# EAGLE design QuadADSR (EAGLE 9.1.1)

## Sheet 1 of 3
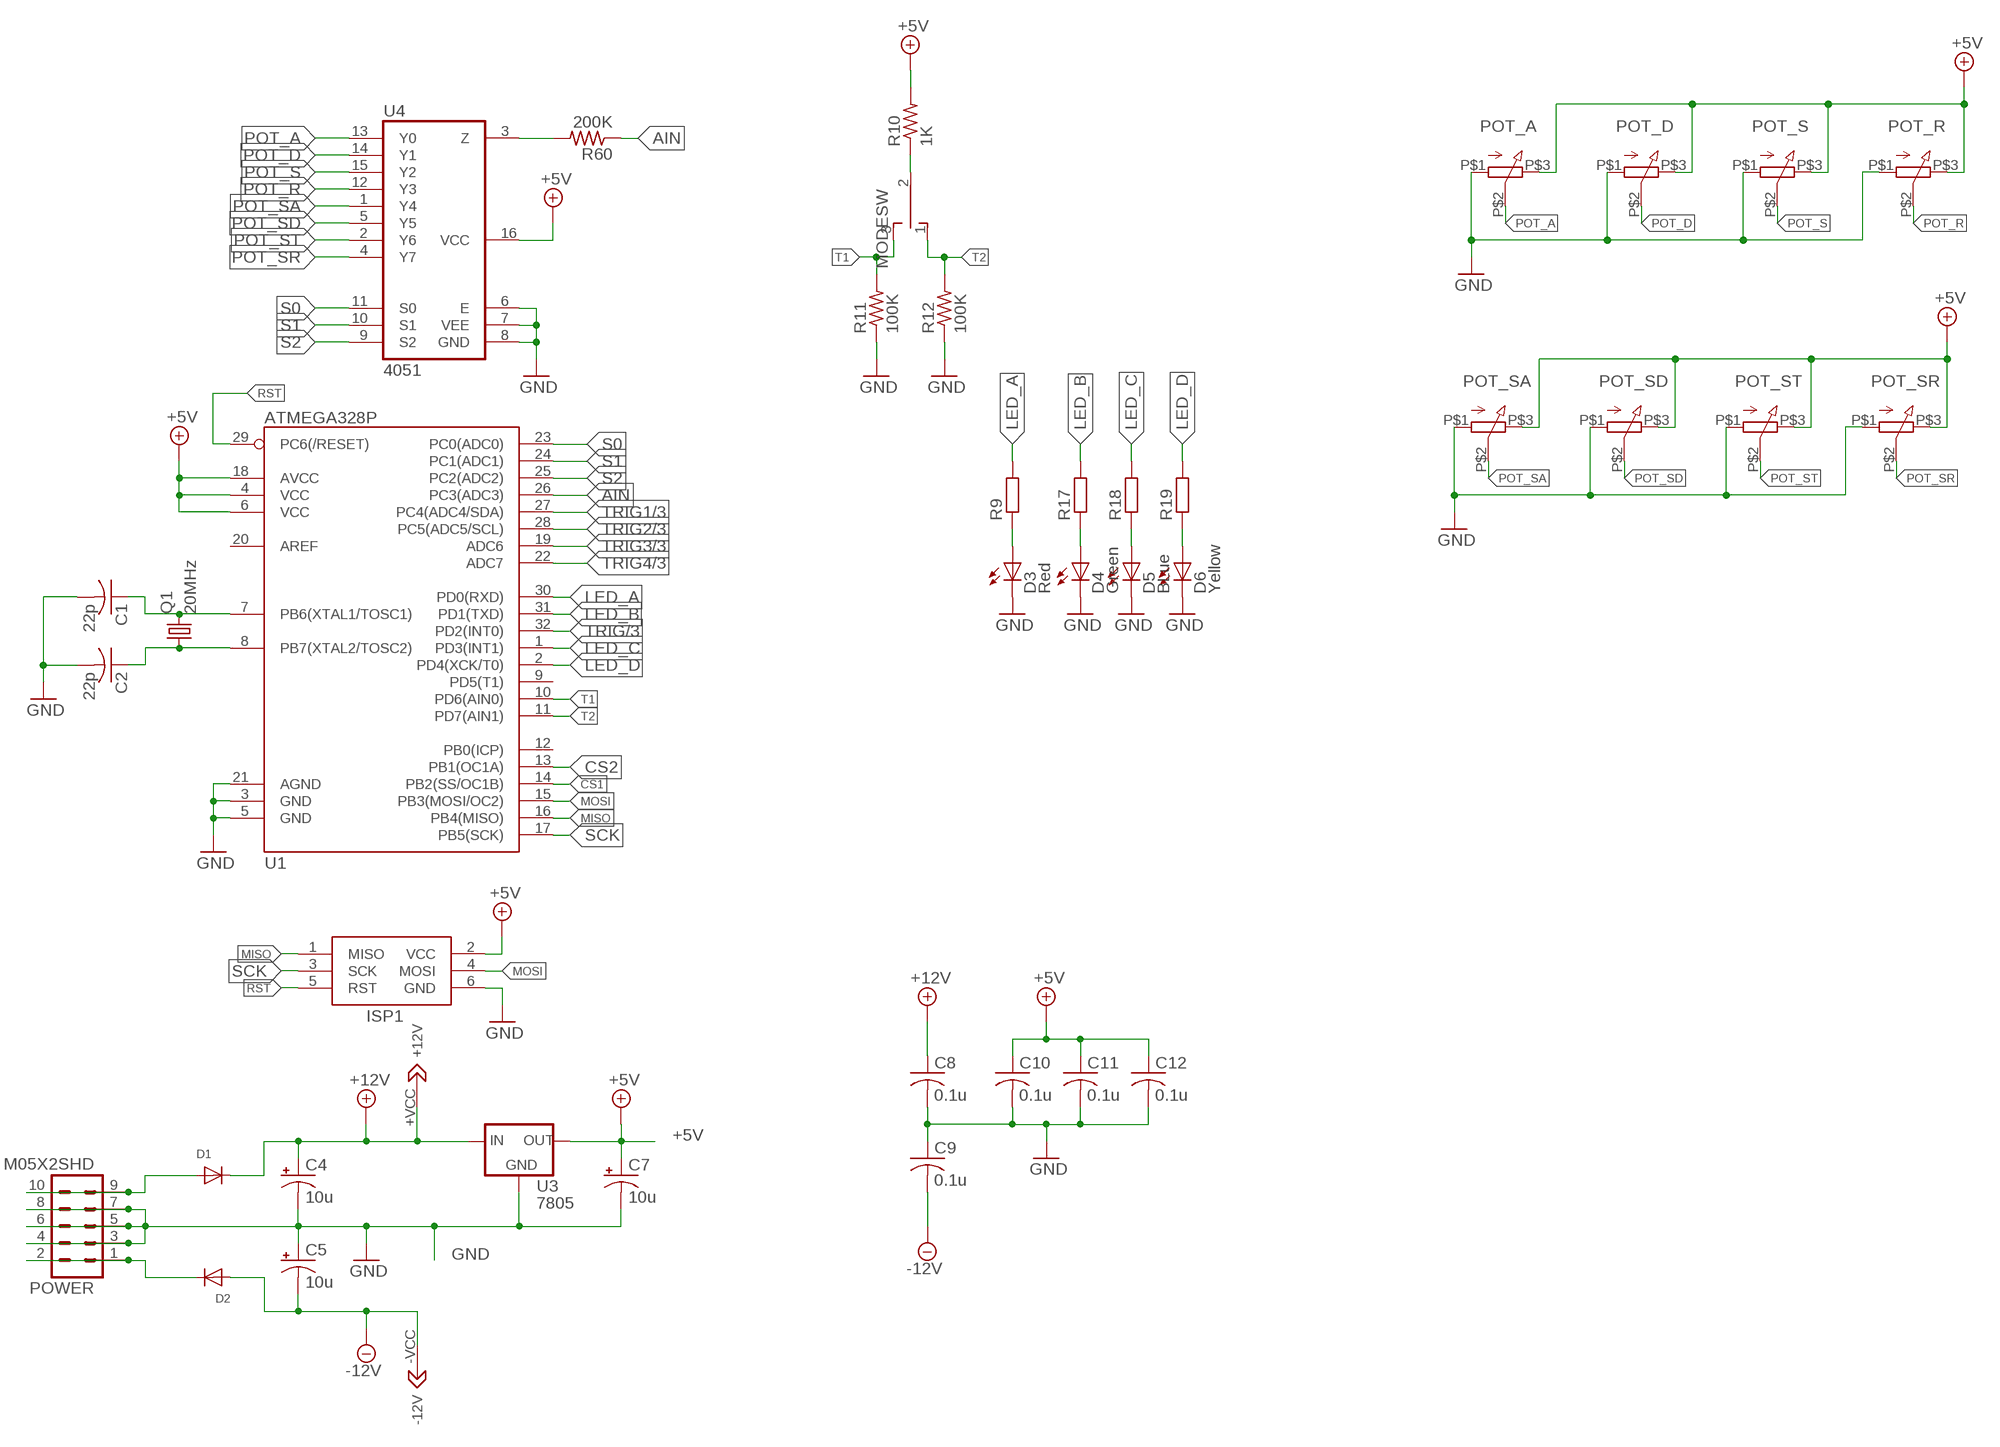
[diagram p0: schematic, sheet 1]

### Parts
C1  22p  C-USC0805K  [C0805K]
C2  22p  C-USC0805K  [C0805K]
C4  10u  CPOL-US153CLV-0505  [153CLV-0505]
C5  10u  CPOL-US153CLV-0505  [153CLV-0505]
C7  10u  CPOL-US153CLV-0505  [153CLV-0505]
C8  0.1u  C-USC0805K  [C0805K]
C9  0.1u  C-USC0805K  [C0805K]
C10  0.1u  C-USC0805K  [C0805K]
C11  0.1u  C-USC0805K  [C0805K]
C12  0.1u  C-USC0805K  [C0805K]
D1  DIODESMA  [SMADIODE]
D2  DIODESMA  [SMADIODE]
D3  Red  LED5MM  [LED5MM]
D4  Green  LED5MM  [LED5MM]
D5  BLue  LED5MM  [LED5MM]
D6  Yellow  LED5MM  [LED5MM]
ISP1  AVRISP-6  [AVRISP]
MODESW  TOGGLE_ON_OFF_ON  [TOGGLE_ON_OFF_ON]
POT_A  Q-POT  [Q-POT]
POT_D  Q-POT  [Q-POT]
POT_R  Q-POT  [Q-POT]
POT_S  Q-POT  [Q-POT]
POT_SA  Q-POT  [Q-POT]
POT_SD  Q-POT  [Q-POT]
POT_SR  Q-POT  [Q-POT]
POT_ST  Q-POT  [Q-POT]
POWER  M05X2SHD  [2X5-SHROUDED]
Q1  20MHz  CRYSTALHC49UP  [HC49UP]
R9  R-EU_R0805  [R0805]
R10  1K  R-US_R0805  [R0805]
R11  100K  R-US_R0805  [R0805]
R12  100K  R-US_R0805  [R0805]
R17  R-EU_R0805  [R0805]
R18  R-EU_R0805  [R0805]
R19  R-EU_R0805  [R0805]
R60  200K  R-US_R0805  [R0805]
U1  ATMEGA328P  ATMEGA328_SMT  [TQFP32-08]
U2  DUAL_OPAMP  [DUAL_OPAMP]
U3  7805  V-REG  [V-REG]
U4  4051  MUX!  [N2222_ARRAY]

### Nets
+5V: C7.+ C10.1 C11.1 C12.1 ISP1.2(VCC) POT_A.P$3 POT_D.P$3 POT_R.P$3 POT_S.P$3 POT_SA.P$3 POT_SD.P$3 POT_SR.P$3 POT_ST.P$3 R10.2 U1.4(VCC) U1.6(VCC) U1.18(AVCC) U3.3(OUT) U4.16(VCC) ; also sheet 2,3
+12V [Power]: C4.+ C8.1 D1.C U2.+VCC(+12V) U3.1(IN)
-12V [Power]: C5.- C9.2 D2.A U2.-VCC(-12V)
AIN: R60.1 U1.26(PC3(ADC3))
CS1: U1.14(PB2(SS/OC1B)) ; also sheet 2
CS2: U1.13(PB1(OC1A)) ; also sheet 2
GND [Power]: C1.2 C2.2 C4.- C5.+ C7.- C8.2 C9.1 C10.2 C11.2 C12.2 D3.K(C) D4.K(C) D5.K(C) D6.K(C) ISP1.6(GND) POT_A.P$1 POT_D.P$1 POT_R.P$1 POT_S.P$1 POT_SA.P$1 POT_SD.P$1 POT_SR.P$1 POT_ST.P$1 POWER.3 POWER.4 POWER.5 POWER.6 POWER.7 POWER.8 R11.1 R12.1 U1.3(GND) U1.5(GND) U1.21(AGND) U3.4(GND) U4.6(E) U4.7(VEE) U4.8(GND) ; also sheet 2,3
LED_A: R9.2 U1.30(PD0(RXD))
LED_B: R17.2 U1.31(PD1(TXD))
LED_C: R18.2 U1.1(PD3(INT1))
LED_D: R19.2 U1.2(PD4(XCK/T0))
MISO: ISP1.1(MISO) U1.16(PB4(MISO))
MOSI: ISP1.4(MOSI) U1.15(PB3(MOSI/OC2)) ; also sheet 2
N$1: C1.1 Q1.2 U1.7(PB6(XTAL1/TOSC1))
N$2: C2.1 Q1.1 U1.8(PB7(XTAL2/TOSC2))
N$9: D1.A POWER.9 POWER.10
N$10: D2.C POWER.1 POWER.2
N$12: MODESW.2(P) R10.1
N$19: D3.A R9.1
N$20: D4.A R17.1
N$21: D5.A R18.1
N$22: D6.A R19.1
N$69: R60.2 U4.3(Z)
POT_A: POT_A.P$2 U4.13(Y0)
POT_D: POT_D.P$2 U4.14(Y1)
POT_R: POT_R.P$2 U4.12(Y3)
POT_S: POT_S.P$2 U4.15(Y2)
POT_SA: POT_SA.P$2 U4.1(Y4)
POT_SD: POT_SD.P$2 U4.5(Y5)
POT_SR: POT_SR.P$2 U4.4(Y7)
POT_ST: POT_ST.P$2 U4.2(Y6)
RST: ISP1.5(RST) U1.29(PC6(/RESET))
S0: U1.23(PC0(ADC0)) U4.11(S0)
S1: U1.24(PC1(ADC1)) U4.10(S1)
S2: U1.25(PC2(ADC2)) U4.9(S2)
SCK: ISP1.3(SCK) U1.17(PB5(SCK)) ; also sheet 2
T1: MODESW.3(S) R11.2 U1.10(PD6(AIN0))
T2: MODESW.1(O) R12.2 U1.11(PD7(AIN1))
TRIG: U1.32(PD2(INT0)) ; also sheet 3
TRIG1: U1.27(PC4(ADC4/SDA)) ; also sheet 3
TRIG2: U1.28(PC5(ADC5/SCL)) ; also sheet 3
TRIG3: U1.19(ADC6) ; also sheet 3
TRIG4: U1.22(ADC7) ; also sheet 3
Unconnected: U1.9(PD5(T1)) U1.12(PB0(ICP)) U1.20(AREF) U2.1OUT(OUT) U2.2OUT(OUT) U2.+1IN(+IN) U2.+2IN(+IN) U2.-1IN(-IN) U2.-2IN(-IN)

## Sheet 2 of 3
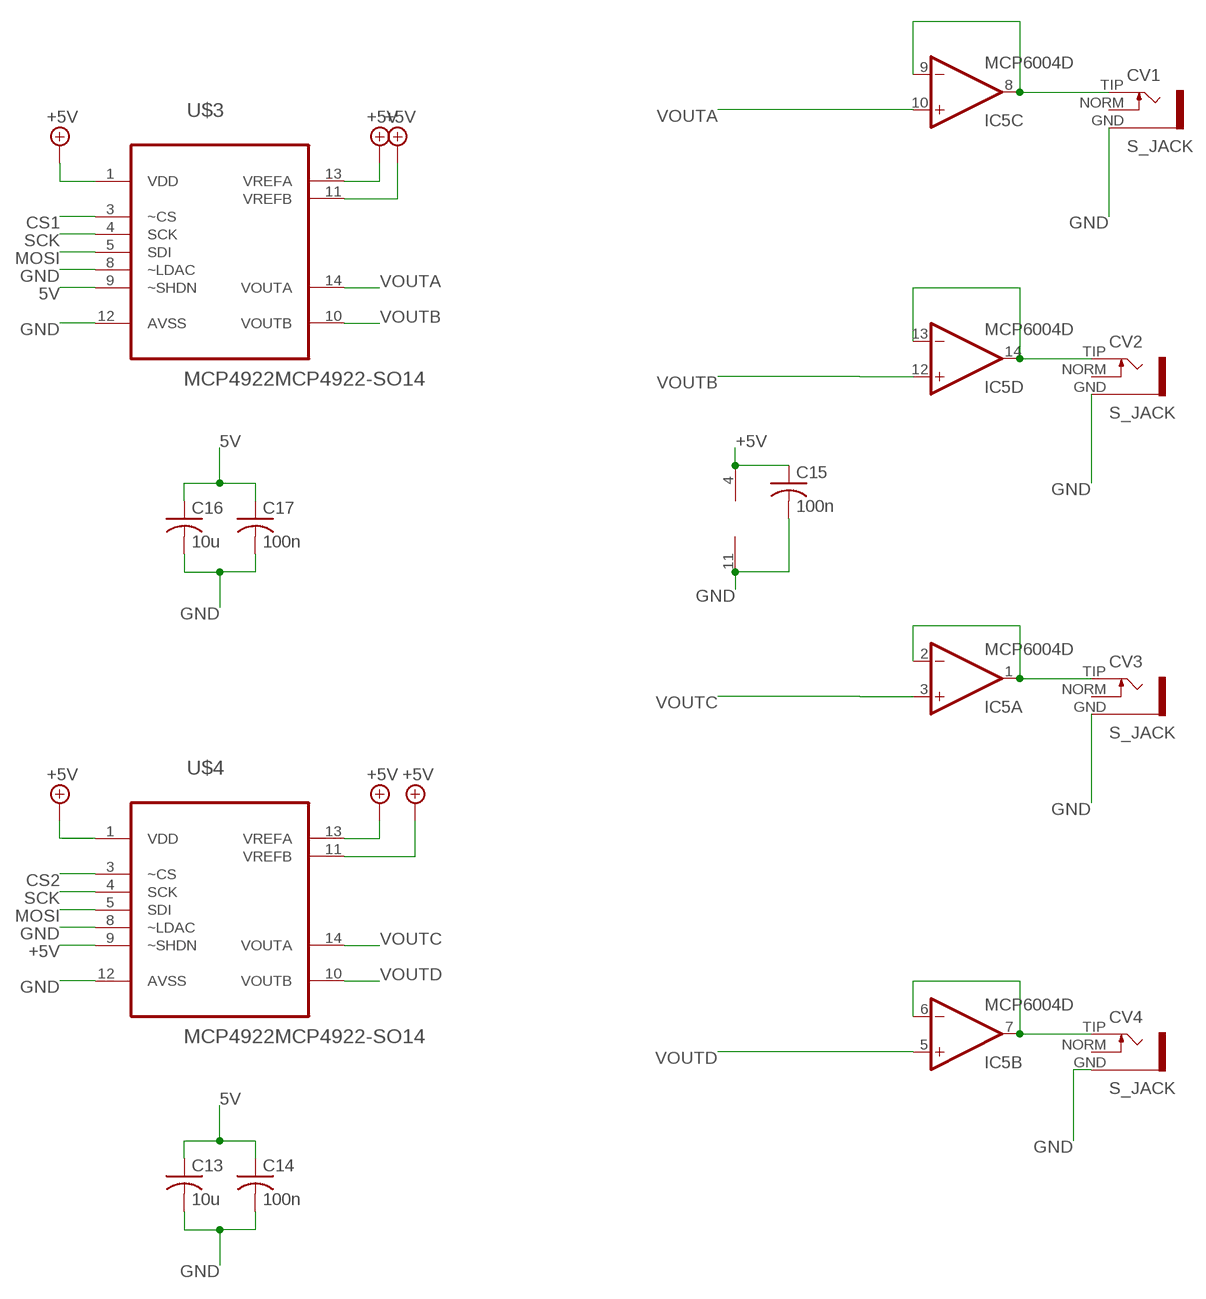
[diagram p1: schematic, sheet 2]

### Parts
C13  10u  C-USC0805K  [C0805K]
C14  100n  C-USC0805K  [C0805K]
C15  100n  C-USC0805K  [C0805K]
C16  10u  C-USC0805K  [C0805K]
C17  100n  C-USC0805K  [C0805K]
CV1  S_JACK  [S_JACK]
CV2  S_JACK  [S_JACK]
CV3  S_JACK  [S_JACK]
CV4  S_JACK  [S_JACK]
IC5  MCP6004D  [SO14]
U$3  MCP4922MCP4922-SO14  [SO14]
U$4  MCP4922MCP4922-SO14  [SO14]

### Nets
5V [Power]: C13.1 C14.1 C16.1 C17.1 U$3.9(~SHDN)
+5V: C15.1 IC5.4(P:V+) U$3.1(VDD) U$3.11(VREFB) U$3.13(VREFA) U$4.1(VDD) U$4.9(~SHDN) U$4.11(VREFB) U$4.13(VREFA) ; also sheet 1,3
CS1: U$3.3(~CS) ; also sheet 1
CS2: U$4.3(~CS) ; also sheet 1
GND [Power]: C13.2 C14.2 C15.2 C16.2 C17.2 CV1.GND CV2.GND CV3.GND CV4.GND IC5.11(P:V-) U$3.8(~LDAC) U$3.12(AVSS) U$4.8(~LDAC) U$4.12(AVSS) ; also sheet 1,3
MOSI: U$3.5(SDI) U$4.5(SDI) ; also sheet 1
N$13: CV1.TIP IC5.8(C:OUT) IC5.9(C:-IN)
N$25: CV4.TIP IC5.6(B:-IN) IC5.7(B:OUT)
N$31: CV3.TIP IC5.1(A:OUT) IC5.2(A:-IN)
N$36: CV2.TIP IC5.13(D:-IN) IC5.14(D:OUT)
SCK: U$3.4(SCK) U$4.4(SCK) ; also sheet 1
VOUTA: IC5.10(C:+IN) U$3.14(VOUTA)
VOUTB: IC5.12(D:+IN) U$3.10(VOUTB)
VOUTC: IC5.3(A:+IN) U$4.14(VOUTA)
VOUTD: IC5.5(B:+IN) U$4.10(VOUTB)
Unconnected: CV1.NORM CV2.NORM CV3.NORM CV4.NORM

## Sheet 3 of 3
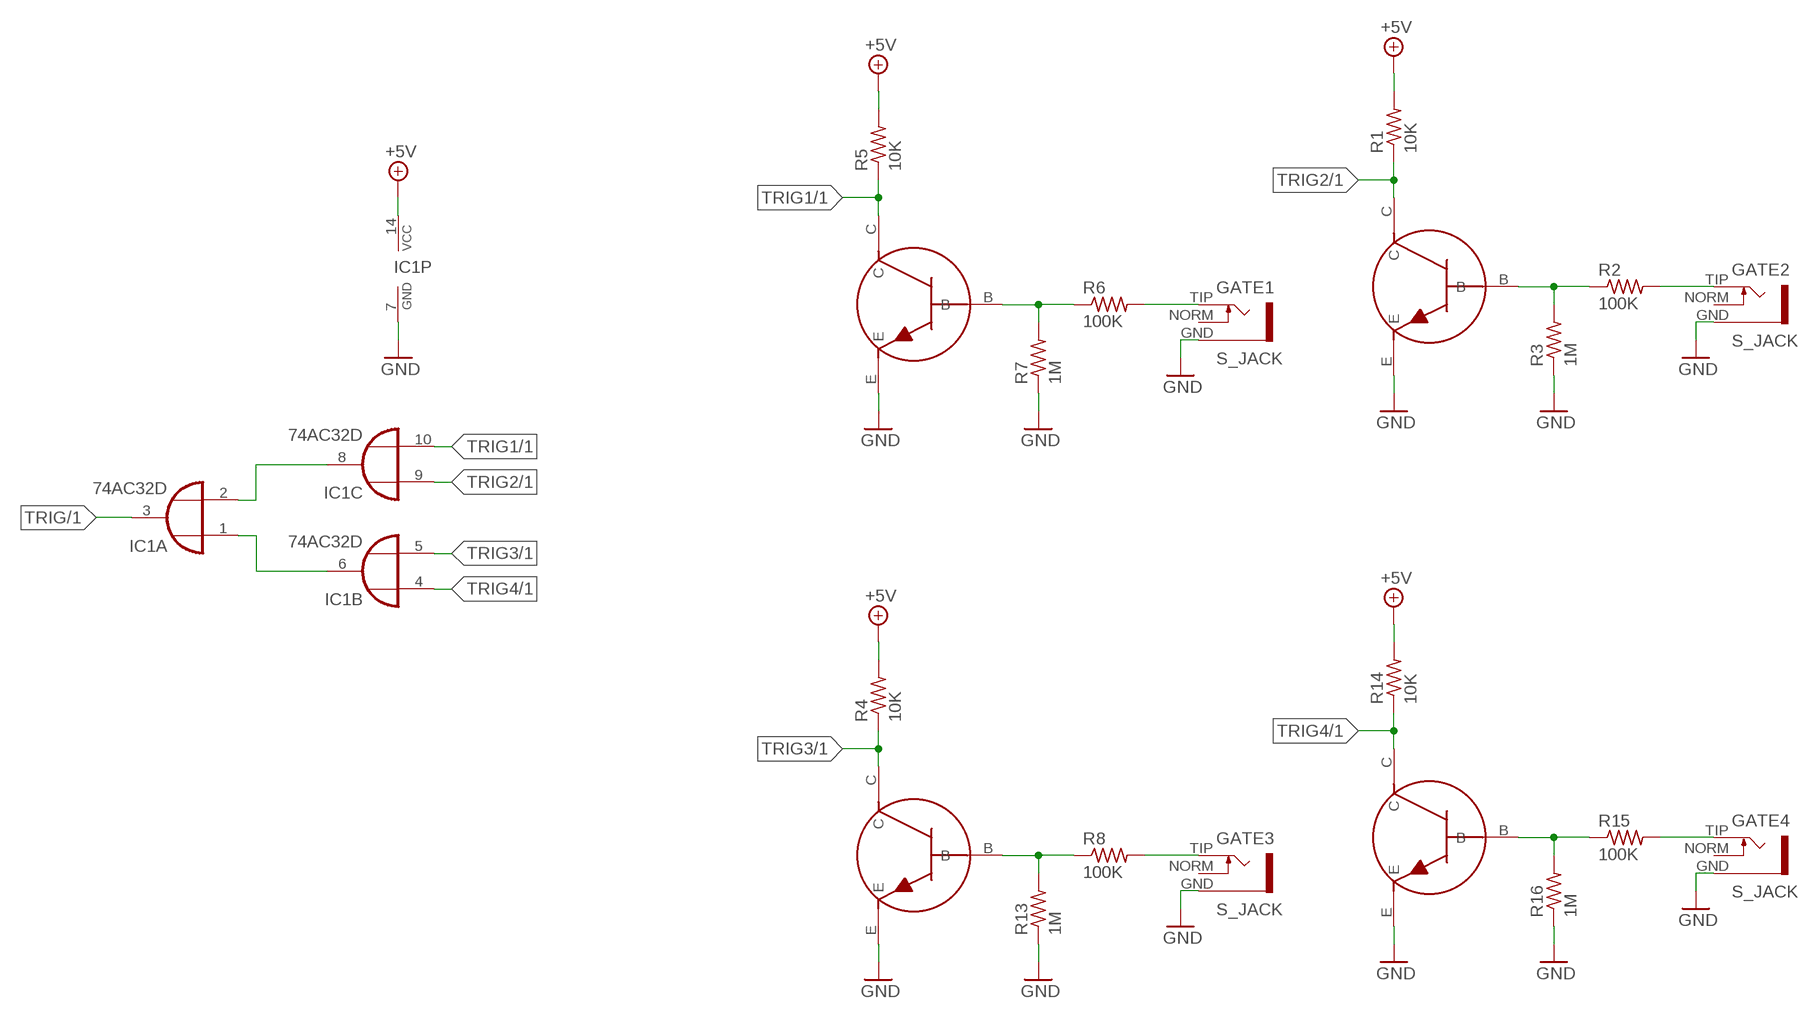
[diagram p2: schematic, sheet 3]

### Parts
GATE1  S_JACK  [S_JACK]
GATE2  S_JACK  [S_JACK]
GATE3  S_JACK  [S_JACK]
GATE4  S_JACK  [S_JACK]
IC1  74AC32D  [SO14]
R1  10K  R-US_R0805  [R0805]
R2  100K  R-US_R0805  [R0805]
R3  1M  R-US_R0805  [R0805]
R4  10K  R-US_R0805  [R0805]
R5  10K  R-US_R0805  [R0805]
R6  100K  R-US_R0805  [R0805]
R7  1M  R-US_R0805  [R0805]
R8  100K  R-US_R0805  [R0805]
R13  1M  R-US_R0805  [R0805]
R14  10K  R-US_R0805  [R0805]
R15  100K  R-US_R0805  [R0805]
R16  1M  R-US_R0805  [R0805]
T1  2N3904  TRANSISTOR_MMBT3904  [TRANSISTOR_SINGLE_N-TYPE]
T2  2N3904  TRANSISTOR_MMBT3904  [TRANSISTOR_SINGLE_N-TYPE]
T3  2N3904  TRANSISTOR_MMBT3904  [TRANSISTOR_SINGLE_N-TYPE]
T4  2N3904  TRANSISTOR_MMBT3904  [TRANSISTOR_SINGLE_N-TYPE]

### Nets
+5V: IC1.14(P:VCC) R1.2 R4.2 R5.2 R14.2 ; also sheet 1,2
GND [Power]: GATE1.GND GATE2.GND GATE3.GND GATE4.GND IC1.7(P:GND) R3.1 R7.1 R13.1 R16.1 T1.E T2.E T3.E T4.E ; also sheet 1,2
N$3: R2.1 R3.2 T2.B
N$4: GATE2.TIP R2.2
N$5: R8.1 R13.2 T3.B
N$6: GATE3.TIP R8.2
N$7: R15.1 R16.2 T4.B
N$8: GATE4.TIP R15.2
N$11: IC1.2(A:I1) IC1.8(C:O)
N$14: IC1.1(A:I0) IC1.6(B:O)
N$15: R6.1 R7.2 T1.B
N$18: GATE1.TIP R6.2
TRIG: IC1.3(A:O) ; also sheet 1
TRIG1: IC1.10(C:I1) R5.1 T1.C ; also sheet 1
TRIG2: IC1.9(C:I0) R1.1 T2.C ; also sheet 1
TRIG3: IC1.5(B:I1) R4.1 T3.C ; also sheet 1
TRIG4: IC1.4(B:I0) R14.1 T4.C ; also sheet 1
Unconnected: GATE1.NORM GATE2.NORM GATE3.NORM GATE4.NORM IC1.11(D:O) IC1.12(D:I0) IC1.13(D:I1)

## Library data of the parts
C1 C2 C8-C17 = rcl:C-US: CAPACITOR, American symbol; SPICEPREFIX: C
C4 C5 C7 = rcl:CPOL-US: POLARIZED CAPACITOR, American symbol; SPICEPREFIX: C
CV1-CV4 GATE1-GATE4 = INSTRUO:S_JACK
D1 D2 = adafruit:DIODE: Diode SMADIODE - SMA Surface Mount Package 20V 1A Schottky Diode Digikey: 641-1014-6-ND DO-1N4148 - Through Hole Small Current Diode SOD-123 20V 1 A (.5mV Vf) Schottky Diode - Digikey: MBRX120TPMSCT-ND SOD-323 10V 570mA (.38mV Vf, 3ns) Schottky Diode - Digikey: ZLLS410CT-ND SOD-523 30V 30mA Schottky Diode (RB751S-40TE61) - Digikey: RB751S-40TE61CT-ND SOT23-R/W - SOT23 Package (R = Solder Paste/Reflow Ovens, W = Hand-Soldering) BAT54Film 40V 300mA - Digikey: 497-7162-1-ND
D3-D6 = led:LED: LED OSRAM: - CHIPLED LG R971, LG N971, LY N971, LG Q971, LY Q971, LO R971, LY R971 LH N974, LH R974 LS Q976, LO Q976, LY Q976 LO Q996 - Hyper CHIPLED LW Q18S LB Q993, LB Q99A, LB R99A - SideLED LS A670, LO A670, LY A670, LG A670, LP A670 LB A673, LV A673, LT A673, LW A673 LH A674 LY A675 LS A676, LA A676, LO A676, LY A676, LW A676 LS A679, LY A679, LG A679 - Hyper Micro SIDELED® LS Y876, LA Y876, LO Y876, LY Y876 LT Y87S - SmartLED LW L88C, LW L88S LB L89C, LB L89S, LG L890 LS L89K, LO L89K, LY L89K LS L896, LA L896, LO L896, LY L896 - TOPLED LS T670, LO T670, LY T670, LG T670, LP T670 LSG T670, LSP T670, LSY T670, LOP T670, LYG T670 LG T671, LOG T671, LSG T671 LB T673, LV T673, LT T673, LW T673 LH T674 LS T676, LA T676, LO T676, LY T676, LB T676, LH T676, LSB T676, LW T676 LB T67C, LV T67C, LT T67C, LS T67K, LO T67K, LY T67K, LW E67C LS E67B, LA E67B, LO E67B, LY E67B, LB E67C, LV E67C, LT E67C LW T67C LS T679, LY T679, LG T679 LS T770, LO T770, LY T770, LG T770, LP T770 LB T773, LV T773, LT T773, LW T773 LH T774 LS E675, LA E675, LY E675, LS T675 LS T776, LA T776, LO T776, LY T776, LB T776 LHGB T686 LT T68C, LB T68C - Hyper Mini TOPLED® LB M676 - Mini TOPLED Santana® LG M470 LS M47K, LO M47K, LY M47K Source: http://www.osram.convergy.de LUXEON: - LUMILED® LXK2-PW12-R00, LXK2-PW12-S00, LXK2-PW14-U00, LXK2-PW14-V00 LXK2-PM12-R00, LXK2-PM12-S00, LXK2-PM14-U00 LXK2-PE12-Q00, LXK2-PE12-R00, LXK2-PE12-S00, LXK2-PE14-T00, LXK2-PE14-U00 LXK2-PB12-K00, LXK2-PB12-L00, LXK2-PB12-M00, LXK2-PB14-N00, LXK2-PB14-P00, LXK2-PB14-Q00 LXK2-PR12-L00, LXK2-PR12-M00, LXK2-PR14-Q00, LXK2-PR14-R00 LXK2-PD12-Q00, LXK2-PD12-R00, LXK2-PD12-S00 LXK2-PH12-R00, LXK2-PH12-S00 LXK2-PL12-P00, LXK2-PL12-Q00, LXK2-PL12-R00 Source: www.luxeon.com KINGBRIGHT: KA-3528ASYC Source: www.kingbright.com
IC1 = 74xx-eu:74*32: Quad 2-input OR gate
IC5 = GMSN-R2Project:MCP6004: OP AMP
ISP1 = adafruit:AVRISP: AVR ISP HEADER Standard 6 pin header for AVR programming
MODESW = INSTRUO:TOGGLE_ON_OFF_ON
POT_A POT_D POT_R POT_S POT_SA POT_SD POT_SR POT_ST = INSTRUO:Q-POT
POWER = SparkFun-Connectors:M05X2: Header 5x2 Standard 10-pin dual row 0.1" header. Commonly used with AVR-ISP. Use with Spark Fun Electronics SKU: PRT-00778
Q1 = adafruit:CRYSTAL: CRYSTAL; OC_FARNELL: unknown; OC_NEWARK: unknown
R1-R8 R10-R16 = rcl:R-US_: RESISTOR, American symbol; SPICEPREFIX: R
R9 R17-R19 = resistor:R-EU_: RESISTOR, European symbol
R60 = rcl:R-US_: RESISTOR, American symbol
T1-T4 = INSTRUO:TRANSISTOR_MMBT3904
U1 = SparkFun-DigitalIC:ATMEGA328_SMT: 32-Pin Atmega328 part Commonly used on Arduino compatible boards Available in QFP and QFN packages TQFP is IC-09069 QFN is non-stock; PROD_ID: IC-09069
U2 = INSTRUO:DUAL_OPAMP
U3 = INSTRUO:V-REG
U4 = INSTRUO:MUX!
U$3 U$4 = GMSN-R2Project:MCP4922

## Net classes
1 Power: width 0.5 mm

## Board
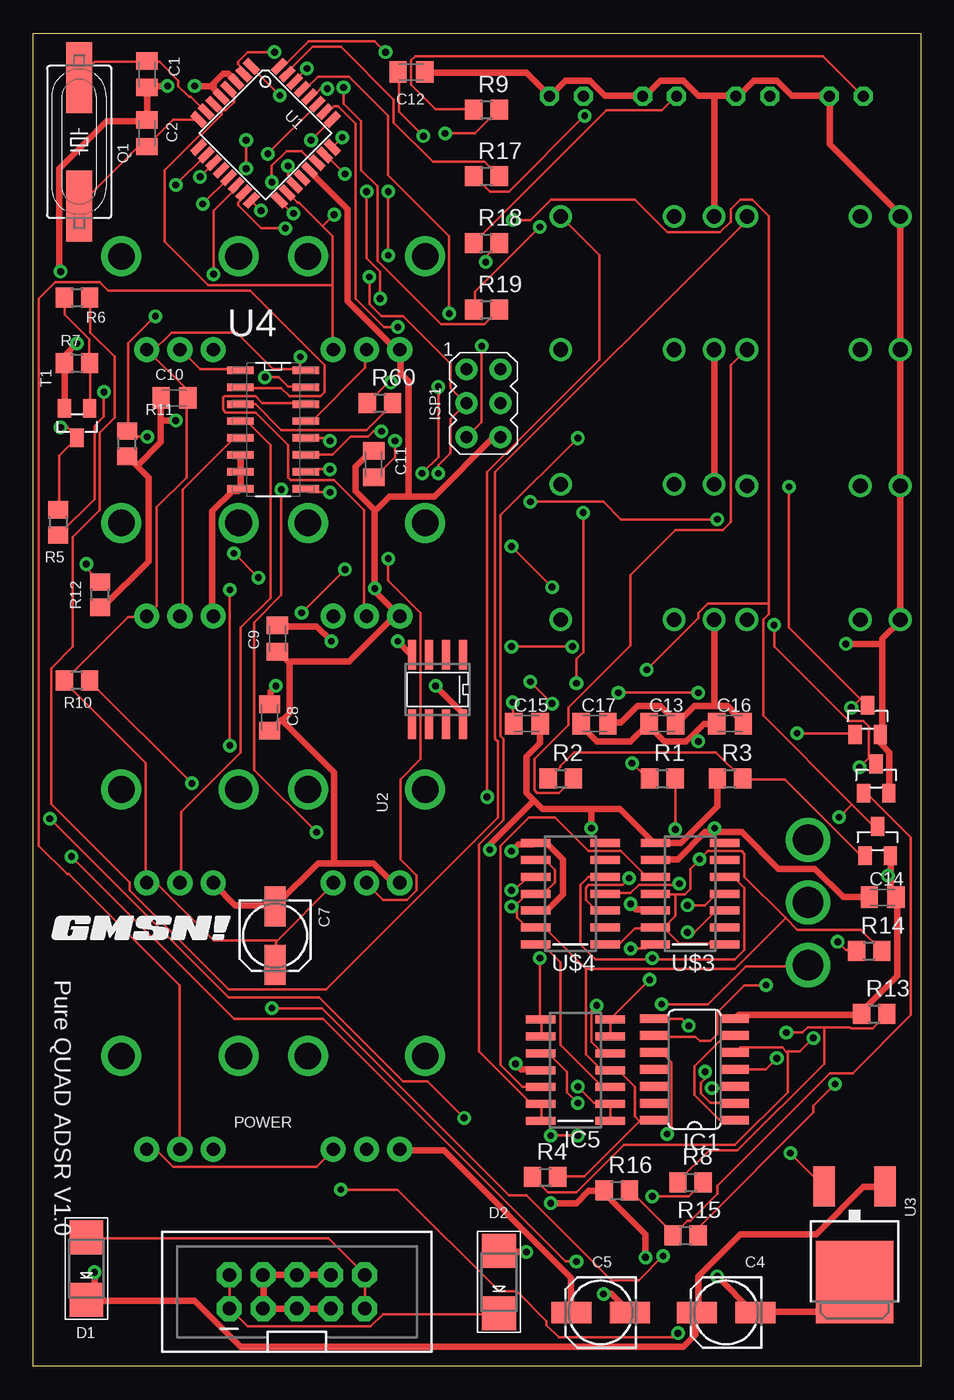
[diagram p3: board, top side]
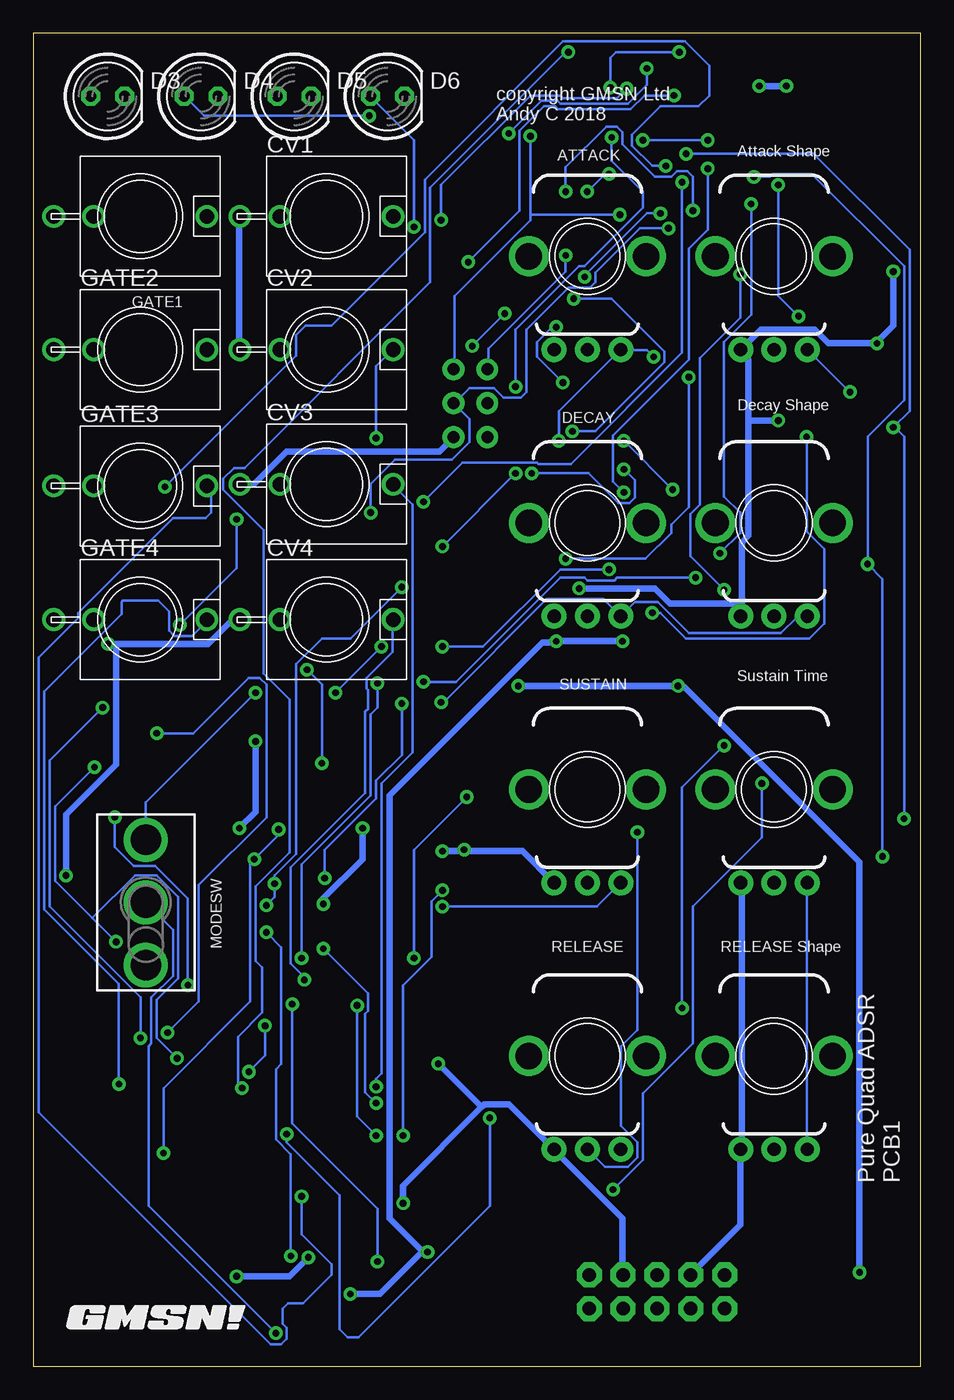
[diagram p4: board, bottom side, seen from below]

Size 66.58 x 100 mm. Coordinates in mm from the lower left corner, seen from the top.
Outline: 66.58,0 0,0 0,100 66.58,100 66.58,0
Copper layers (1*16): Top 0.035mm / dielectric 1.5mm / Bottom 0.035mm
Design rules "SparkFun": minimum track width 8mil, minimum drill 20mil, track to track 8mil, track to pad 8mil, pad to pad 8mil, via to via 8mil, smd to smd 8mil, copper to edge 10mil, drill to drill 8mil, minimum pad ring 12mil, minimum via ring 10mil, stop-mask expansion 4mil, vias tented up to drill 25mil, thermal gap 10mil

### Footprints (pad centres in the part's own frame; a part is rotated, then mirrored left to right if it is on the bottom)
C0805K = smd 1.3 x 1.6: 1 -1,0; 2 1,0
153CLV-0505 = smd 3 x 1.6: + 2.2,0; - -2.2,0
S_JACK = drill 1.1: GND 0,-6.5; NORM 0,-3.5; TIP 0,5
SMADIODE = smd 2.54 x 2.54: A 2.349,0; C -2.349,0
LED5MM = drill 0.813 octagon: A -1.27,0; K 1.27,0
SO14 = smd 0.66 x 2.032: 1 -3.81,-3.073; 2 -2.54,-3.073; 3 -1.27,-3.073; 4 0,-3.073; 5 1.27,-3.073; 6 2.54,-3.073; 7 3.81,-3.073; 8 3.81,3.073; 9 2.54,3.073; 10 1.27,3.073; 11 0,3.073; 12 -1.27,3.073; 13 -2.54,3.073; 14 -3.81,3.073
SO14' = smd 0.6 x 2.2: 1 -3.81,-2.6; 2 -2.54,-2.6; 3 -1.27,-2.6; 4 0,-2.6; 5 1.27,-2.6; 6 2.54,-2.6; 7 3.81,-2.6; 8 3.81,2.6; 9 2.54,2.6; 10 1.27,2.6; 11 0,2.6; 12 -1.27,2.6; 13 -2.54,2.6; 14 -3.81,2.6
AVRISP = drill 0.9 pad 1.626: 1 -1.27,2.54; 2 1.27,2.54; 3 -1.27,0; 4 1.27,0; 5 -1.27,-2.54; 6 1.27,-2.54
TOGGLE_ON_OFF_ON = drill 2.3: 1 -4.7,0; 2 0,0; 3 4.7,0
Q-POT = drill 1 pad 1.88: P$1 -2.5,-7; P$2 0,-7; P$3 2.5,-7 | drill 2 pad 2.68: P$4 -4.4,0; P$5 4.4,0
2X5-SHROUDED = drill 1.016 pad 1.88 octagon: 1 -1.27,5.08; 2 1.27,5.08; 3 -1.27,2.54; 4 1.27,2.54; 5 -1.27,0; 6 1.27,0; 7 -1.27,-2.54; 8 1.27,-2.54; 9 -1.27,-5.08; 10 1.27,-5.08
HC49UP = smd 5.334 x 1.93: 1 -4.826,0; 2 4.826,0
R0805 = smd 1.3 x 1.5: 1 -0.95,0; 2 0.95,0
TRANSISTOR_SINGLE_N-TYPE = smd 1 x 1.4: B -0.95,-1.1; C 0,1.1; E 0.95,-1.1
TQFP32-08 = smd 1.27 x 0.559: 1 -4.293,2.8; 2 -4.293,2; 3 -4.293,1.2; 4 -4.293,0.4; 5 -4.293,-0.4; 6 -4.293,-1.2; 7 -4.293,-2; 8 -4.293,-2.8; 17 4.293,-2.8; 18 4.293,-2; 19 4.293,-1.2; 20 4.293,-0.4; 21 4.293,0.4; 22 4.293,1.2; 23 4.293,2; 24 4.293,2.8 | smd 0.559 x 1.27: 9 -2.8,-4.293; 10 -2,-4.293; 11 -1.2,-4.293; 12 -0.4,-4.293; 13 0.4,-4.293; 14 1.2,-4.293; 15 2,-4.293; 16 2.8,-4.293; 25 2.8,4.293; 26 2,4.293; 27 1.2,4.293; 28 0.4,4.293; 29 -0.4,4.293; 30 -1.2,4.293; 31 -2,4.293; 32 -2.8,4.293
DUAL_OPAMP = smd 2.2 x 0.6: 1OUT -2.6,1.905; 2OUT 2.6,0.635; +1IN -2.6,-0.635; +2IN 2.6,-1.905; +VCC 2.6,1.905; -1IN -2.6,0.635; -2IN 2.6,-0.635; -VCC -2.6,-1.905
V-REG = smd 1.6 x 3: 1 -2.28,-4.8; 3 2.28,-4.8 | smd 5.8 x 6.2: 4 0,2.38
N2222_ARRAY = smd 1.981 x 0.559: 1 -2.464,4.445; 2 -2.464,3.175; 3 -2.464,1.905; 4 -2.464,0.635; 5 -2.464,-0.635; 6 -2.464,-1.905; 7 -2.464,-3.175; 8 -2.464,-4.445; 9 2.464,-4.445; 10 2.464,-3.175; 11 2.464,-1.905; 12 2.464,-0.635; 13 2.464,0.635; 14 2.464,1.905; 15 2.464,3.175; 16 2.464,4.445

### Placement (x,y rotation side)
C1  8.53,96.94 270 top
C2  8.53,92.49 90 top
C4  51.98,4.04 180 top
C5  42.58,4.04 180 top
C7  18.14,32.31 270 top
C8  17.73,48.67 270 top
C9  18.32,54.6 90 top
C10  10.59,72.65 180 top
C11  25.54,67.68 90 top
C12  28.37,97.09 0 top
C13  47.2,48.21 0 top
C14  63.73,35.18 0 top
C15  37.04,48.21 0 top
C16  52.28,48.21 0 top
C17  42.12,48.21 0 top
CV1  44.58,86.27 270 bottom
CV2  44.58,76.27 270 bottom
CV3  44.58,66.17 270 bottom
CV4  44.58,56.01 270 bottom
D1  3.99,7.32 90 top
D2  34.94,6.32 90 top
D3  61,95.27 0 bottom
D4  54,95.27 0 bottom
D5  47,95.27 0 bottom
D6  40,95.27 0 bottom
GATE1  58.55,86.27 270 bottom
GATE2  58.55,76.27 270 bottom
GATE3  58.55,66.05 270 bottom
GATE4  58.55,56.01 270 bottom
IC1  49.62,22.27 90 top
IC5  MCP6004D  [SO14']  40.68,22.21 90 top
ISP1  33.78,72.25 0 top
MODESW  58.14,34.79 90 bottom
POT_A  25,83.27 0 bottom
POT_D  25,63.27 0 bottom
POT_R  25,23.27 0 bottom
POT_S  25,43.27 0 bottom
POT_SA  11,83.27 0 bottom
POT_SD  11,63.27 0 bottom
POT_SR  11,43.27 0 bottom
POT_ST  11,23.27 0 bottom
POWER  19.78,5.58 90 top
Q1  3.45,91.85 90 top
R1  47.2,44.11 0 top
R2  39.58,44.11 0 top
R3  52.28,44.11 0 top
R4  38.4,14.19 0 top
R5  1.86,63.31 270 top
R6  3.29,80.17 0 top
R7  3.29,75.25 0 top
R8  49.32,13.81 0 top
R9  34,94.27 0 top
R10  3.29,51.44 180 top
R11  7.03,69.2 90 top
R12  5.03,57.88 90 top
R13  63.1,26.43 0 top
R14  62.72,31.16 0 top
R15  48.94,9.81 0 top
R16  43.78,13.19 0 top
R17  34,89.27 0 top
R18  34,84.27 0 top
R19  34,79.27 0 top
R60  26,72.27 0 top
T1  3.29,70.76 180 top
T2  63.36,39.4 0 top
T3  62.6,48.49 0 top
T4  63.24,44.08 0 top
U1  17.41,92.49 315 top
U2  30.34,50.77 270 top
U3  61.62,8.7 180 top
U4  18,70.27 0 top
U$1  [GMSN!_LOGO]  57.1,3.59 0 bottom
U$2  [GMSN!_LOGO]  8.37,32.8 0 top
U$3  MCP4922MCP4922-SO14  [SO14']  49.28,35.45 90 top
U$4  MCP4922MCP4922-SO14  [SO14']  40.3,35.45 90 top

### Tracks (layer width: path | path; a pad name or v marks a point on that pad's centre or on a via)
5V  (via drill 0.51)
  Top 0.5: C17.1 41.16,48.19 41.16,47.99 42.28,46.87 44.82,46.87 46.14,48.19 C13.1 46.24,47.99 47.36,46.87 48.99,46.87 49.44,47.33 | 49.44,47.33 50.31,48.19 51.22,48.19 C16.1 | 51.12,40.06 50.41,40.06 48.38,38.03 46.75,38.03 U$3.9 | 51.12,40.06 53.15,40.06 55.9,37.32 58.64,37.32 60.77,35.19 62.7,35.19 C14.1 | v49.9,46.87 49.44,47.33 | v51.12,40.37 51.12,40.06
  Bottom 0.5: v49.9,46.87 49.9,41.59 v51.12,40.37
+5V  (via drill 0.51)
  Top 0.203: 36.29,34.48 36.29,34.68 37,35.39 37.61,35.39 U$4.11 37.71,35.49 38.32,35.49 39.13,36.3 39.13,37.22 38.42,37.93 37.71,37.93 U$4.9 | 36.29,34.48 36.29,33.66 37,32.95 37.61,32.95 U$4.13 37.71,32.85 38.42,32.85 41.47,29.8 | 45.48,18.37 45.53,18.42 46.45,18.42 IC1.14 | 45.48,18.37 41.37,14.26 39.44,14.26 R4.2 | 45.48,18.37 45.13,18.73 45.13,20.96 43.91,22.18 43.3,22.18 IC5.4 43.2,22.28 42.59,22.28 41.47,23.4 41.47,29.8 | U$4.1 42.99,31.73 44.01,31.73 45.13,32.85 46.65,32.85 U$3.13 | U$3.1 51.83,31.73 48.48,31.73 47.36,32.85 46.75,32.85 U$3.13 | 56.45,33.61 53.36,36.71 53.36,38.44 53.15,38.64 50.61,38.64 v50,38.03 49.29,37.32 49.29,35.8 48.89,35.39 48.17,35.39 | 56.45,33.61 57.32,32.75 62.09,32.75 63.62,31.22 R14.2 | 48.17,35.39 46.75,35.39 U$3.11 | v48.17,40.27 48.17,44.03 R1.2 | v56.81,15.99 59.25,13.55 U3.3 | 48.17,35.39 48.17,33.77 47.46,33.05 47.46,32.85 U$3.13 | 41.47,29.8 52.65,29.8 56.45,33.61 | v29.28,92.29 27.45,94.12 27.45,97.06 C12.1 | 14.19,94.27 14.24,94.22 14.44,94.22 15.05,94.83 15.05,95.44 14.75,95.74 U1.4 | 14.19,94.27 13.83,94.62 13.63,94.62 U1.6 | 21.71,85.53 22.47,84.77 22.47,81.11 | 21.71,85.53 19.93,87.31 19.83,87.31 19.12,88.02 U1.18 | 22.47,81.11 22.47,76.34 POT_A.P$3 | v27.14,69.43 27.14,68.21 25.62,66.68 C11.1 | 22.47,81.11 13.12,81.11 9.87,84.36 9.87,89.75 12.51,92.39 12.61,92.39 14.14,93.91 14.14,94.22 14.19,94.27 | 21.71,85.53 v22.57,86.39 | POT_ST.P$3 8.55,16.19 9.26,16.19 10.48,14.97 21.25,14.97 22.47,16.19 POT_R.P$3 | 18.25,31.89 22.57,36.2 POT_S.P$3 | 18.25,31.89 18.2,31.83 18.2,30.21 C7.+ | 18.25,31.89 18.2,31.94 13.53,31.94 9.26,36.2 8.55,36.2 POT_SR.P$3 8.45,36.3 8.45,45.25 2.35,51.34 R10.2 2.35,51.44 7.13,56.22 8.45,56.22 POT_SD.P$3 9.26,57.03 9.26,64.45 11.5,66.68 11.5,72.58 C10.1 11.5,72.68 11.5,73.29 8.55,76.23 POT_SA.P$3 8.86,76.03 10.38,77.55 15.26,77.55 18,74.81 20.03,74.81
  Top 0.203: v5.3,73.08 5.3,71.26 4.59,70.54 4.59,65.06 1.95,62.42 R5.2 | 20.03,74.81 20.44,74.81 U4.16 20.03,74.81 | v35.98,49.82 35.98,48.29 C15.1 | 20.03,74.81 v20.03,75.73 | v35.88,34.48 36.29,34.48
  Bottom 0.203: v48.17,40.27 48.17,39.86 v50,38.03 50.31,37.73 50.31,27.36 56.81,20.86 v56.81,15.99 | 29.28,86.39 29.28,85.99 34.97,80.3 34.97,74.81 ISP1.2 | 29.28,86.39 v29.28,92.29 | v27.14,69.43 27.14,71.66 22.57,76.23 POT_A.P$3 22.47,76.23 20.54,76.23 v20.03,75.73 | v22.57,86.39 29.28,86.39 | POT_ST.P$3 8.55,16.29 8.55,36.2 POT_SR.P$3 | v5.3,73.08 8.45,76.23 POT_SA.P$3 | v35.98,49.82 35.78,49.82 28.06,57.54 23.79,57.54 22.57,56.32 POT_D.P$3 22.47,56.32 21.45,57.34 19.73,57.34 17.39,55 10.48,55 9.26,56.22 8.55,56.22 POT_SD.P$3 | v35.88,34.48 24.3,34.48 22.57,36.2 POT_S.P$3
+12V  (via drill 0.51)
  Top 0.5: v18.2,51.04 17.8,50.63 17.8,49.72 C8.1 | v30.19,51.04 32.22,49 32.22,48.19 U2.+VCC | U3.1 63.82,13.45 62.3,13.45 58.74,9.89 53.05,9.89 49.9,6.74 49.9,4.2 C4.+ 49.7,4 49.7,2.37 48.78,1.46 15.56,1.46 12.11,4.91 4.08,4.91 D1.C 4.59,5.11 v4.59,7.04
  Bottom 0.5: v30.19,51.04 v18.2,51.04 18,50.94 17.69,50.94 4.59,37.83 v4.59,7.04
-12V  (via drill 0.51)
  Top 0.5: v22.37,54.39 21.25,55.51 18.41,55.51 C9.2 | v27.35,54.39 28.36,53.37 U2.-VCC | v37,8.57 34.97,8.57 D2.A | v42.79,5.42 43.4,5.42 44.72,4.1 C5.-
  Bottom 0.5: v22.37,54.39 v27.35,54.39 27.55,54.29 28.36,54.29 39.84,42.81 39.84,11.11 37.51,8.77 37.41,8.57 | 37.41,8.57 v37,8.57 | 37.41,8.57 40.55,5.42 v42.79,5.42
AIN  (via drill 0.51)
  Top 0.203: v27.35,77.96 26.33,77.96 24.2,80.09 24.2,93.2 22.88,94.52 22.57,94.52 22.16,94.12 21.96,94.12 U1.26 | v26.84,73.8 26.64,73.8 25.11,72.27 R60.1
  Bottom 0.203: v27.35,77.96 27.65,77.96 28.77,76.84 28.77,75.73 v26.84,73.8
CS1  (via drill 0.51)
  Top 0.203: v13.53,81.92 13.53,86.7 15.15,88.32 15.15,88.53 U1.14 | v14.75,46.57 v14.75,58.25 | v17.9,26.86 21.66,26.86 35.68,12.84 37,12.84 43.4,6.43 45.43,6.43 v47.26,8.26 | v49.09,32.55 49.6,32.55 51.22,34.17 51.83,34.17 U$3.3
  Bottom 0.203: v13.53,81.92 13.53,78.67 16.58,75.62 16.58,64.65 17.29,63.94 17.29,60.79 v14.75,58.25 | v14.75,46.57 17.9,43.42 v17.9,26.86 | v47.26,8.26 47.26,15.88 48.38,17 48.38,22.28 47.97,22.69 47.97,31.43 v49.09,32.55
CS2  (via drill 0.51)
  Top 0.203: v12.72,87.21 14.65,89.14 U1.13 | v16.88,59.16 v15.05,60.99 | v38.93,49.72 v37.3,51.34 | v44.72,36.61 44.21,36.1 41.67,36.1 41.47,35.9 41.47,34.98 42.18,34.27 42.89,34.27 U$4.3
  Bottom 0.203: v12.72,87.21 12.72,78.88 14.75,76.84 14.75,65.26 13.53,64.04 13.53,62.52 v15.05,60.99 | v16.88,59.16 22.77,59.16 22.98,58.96 25.01,58.96 25.21,59.16 27.04,59.16 34.87,51.34 v37.3,51.34 | v38.93,49.72 38.93,45.86 40.86,43.92 40.86,42.6 44.72,38.74 v44.72,36.61
GND  (via drill 0.51)
  Top 0.5: CV3.GND 51.12,66.18 51.12,76.23 CV2.GND | C12.2 29.38,97.06 37,97.06 38.73,95.33 D6.K 38.93,95.44 39.95,96.45 41.77,96.45 42.89,95.33 45.63,95.33 D5.K 45.94,95.33 47.06,96.45 48.78,96.45 49.9,95.33 51.12,95.33 | 51.12,95.33 52.65,95.33 D4.K 52.95,95.33 54.07,96.45 55.79,96.45 56.91,95.33 59.66,95.33 D3.K 59.76,95.03 59.76,91.68 64.94,86.5 GATE1.GND 65.04,86.19 65.04,76.34 GATE2.GND 65.04,76.03 65.04,66.28 GATE3.GND 65.04,65.97 65.04,56.22 GATE4.GND 65.04,55.91 63.72,54.59 63.72,54.19 | 51.12,95.33 51.12,86.29 CV1.GND | 64.33,36.81 64.33,35.49 64.63,35.19 C14.2 64.84,34.98 64.84,29.29 62.2,26.65 R13.1 62.09,26.35 52.95,26.35 52.75,26.14 IC1.7 | 64.33,36.81 64.33,38.24 T2.E | C17.2 43.2,48.29 44.11,48.29 45.33,49.51 47.06,49.51 48.28,48.29 C13.2 48.48,48.4 49.6,49.51 51.12,49.51 | 51.12,49.51 52.14,49.51 52.44,49.21 52.44,49.11 53.25,48.29 C16.2 | 51.12,49.51 51.12,55.91 CV4.GND | T4.E 64.23,43.01 64.23,46.06 63.62,46.67 63.62,47.38 T3.E 63.72,47.58 63.72,54.19 | 63.72,54.19 v60.98,54.19 | v64.13,36.81 64.33,36.81 | POWER.7 22.27,4.3 20.03,4.3 POWER.5 19.73,4.3 17.29,4.3 POWER.3 17.29,4.5 17.29,6.84 POWER.4 17.49,6.84 19.73,6.84 POWER.6 20.03,6.84 22.27,6.84 POWER.8 | U3.4 61.59,6.23 59.45,4.1 54.27,4.1 C4.- 53.97,4.1 v51.32,6.74 | v38.83,12.23 40.76,12.23 41.67,13.14 42.79,13.14 R16.1 42.89,12.94 45.94,9.89 v45.94,8.16 | v36.19,22.69 36.59,22.28 38.01,22.28 IC5.11 | C5.+ 40.35,4.1 40.35,6.64 30.8,16.19 27.55,16.19 POT_R.P$1 | 7.79,67.55 7.13,68.21 R11.1 | 7.79,67.55 8.65,66.68 8.65,60.38 5.3,57.03 5.1,57.03 R12.1 | 9.57,70.95 9.57,69.33 7.79,67.55
  Top 0.5: 9.57,70.95 9.57,72.58 C10.2 | U4.6 15.56,68.31 15.56,67.29 U4.7 15.56,67.09 15.56,65.87 U4.8 15.36,65.67 14.95,65.67 13.43,64.14 13.43,56.32 POT_SD.P$1 | 13.53,96.05 13.53,96.25 14.24,96.96 14.65,96.96 15.15,96.45 U1.3 | 13.53,96.05 13.53,95.84 14.04,95.33 U1.5 | v12.11,96.05 13.53,96.05 | v10.07,96.05 8.75,96.05 C1.2 8.55,95.84 8.55,93.51 C2.2 8.35,93.4 5.5,93.4 1.95,89.85 1.95,82.23 v2.05,82.13 | T1.E 2.35,71.86 2.35,75.22 R7.1 2.45,75.42 2.45,75.93 v3.27,76.74 | v10.68,70.95 9.57,70.95 | R3.1 51.32,44.03 51.32,42 48.58,39.25 46.75,39.25 U$3.8 46.45,39.35 44.01,41.79 41.88,41.79 | 37.56,42.45 38.22,41.79 41.88,41.79 | 37.56,42.45 37,43.01 37,45.75 38.01,46.77 38.01,48.19 C15.2 | v44.82,34.68 45.23,34.27 46.65,34.27 U$3.12 | 41.88,41.79 v41.88,40.37 | U$4.12 37.71,34.27 38.62,34.27 39.74,35.39 39.74,38.03 38.52,39.25 U$4.8 37.51,39.15 36.39,39.15 v35.88,38.64 | POT_SR.P$1 13.53,36.2 15.15,34.58 18.1,34.58 C7.- 18.3,34.68 21.35,37.73 22.57,37.73 | 22.57,37.73 25.52,37.73 26.94,36.3 27.45,36.3 POT_S.P$1 | 37.56,42.45 34.26,39.15 v34.26,38.74 | U1.21 20.74,89.64 23.59,86.8 23.59,79.89 27.14,76.34 27.45,76.34 POT_A.P$1 27.55,76.03 27.55,74.51 28.16,73.9 28.16,65.26 | 18.71,48.5 18.61,48.5 17.8,47.68 C8.2 | 18.71,48.5 19.22,49 19.22,52.76 | 19.22,52.76 18.41,53.58 C9.1 | 25.62,64.24 24.2,65.67 24.2,67.5 25.31,68.61 25.52,68.61 C11.2 | 25.62,64.24 v25.62,58.35 25.62,58.15 27.45,56.32 POT_D.P$1 27.14,56.32 23.69,52.87 19.42,52.87 19.22,52.76 | 28.16,65.26 26.74,65.26 25.82,64.35 25.62,64.24 | 28.16,65.26 30.09,65.26 34.46,69.63 34.97,69.63 ISP1.6 | 22.57,37.73 22.57,44.53 18.81,48.29 18.71,48.5
  Bottom 0.5: CV2.GND 51.12,76.34 51.12,86.19 CV1.GND | v60.98,54.19 60.37,54.19 | 60.37,54.19 53.46,54.19 51.73,55.91 51.12,55.91 CV4.GND | v64.13,36.81 64.13,41.39 60.37,45.14 60.37,54.19 | POWER.4 17.19,6.94 13.53,10.6 13.53,16.19 POT_ST.P$1 13.43,16.49 13.43,36.2 POT_SR.P$1 | v38.83,12.23 38.83,13.55 32.93,19.44 | 32.93,19.44 32.73,19.64 30.9,19.64 27.55,16.29 POT_R.P$1 27.35,16.09 22.37,11.11 22.37,6.94 POWER.8 | 32.93,19.44 v36.19,22.69 | v51.32,6.74 47.36,6.74 v45.94,8.16 | v10.07,96.05 v12.11,96.05 | v2.05,82.13 2.05,78.06 3.17,76.94 v3.27,76.74 6.92,76.74 7.94,77.76 12.01,77.76 13.43,76.34 POT_SA.P$1 13.43,76.03 12.92,75.52 12.92,70.95 | 13.43,57.23 13.43,61.81 12.92,62.31 12.92,70.95 | 13.43,57.23 13.43,56.32 POT_SD.P$1 | 12.92,70.95 v10.68,70.95 | v44.82,34.68 44.82,35.09 41.88,38.03 v41.88,40.37 | 34.26,38.64 29.89,38.64 27.55,36.3 POT_S.P$1 | 34.26,38.64 v35.88,38.64 | v34.26,38.74 34.26,38.64 | 13.43,57.23 18.81,57.23 19.93,58.35 v25.62,58.35 | CV3.GND 51.02,66.18 50,66.18 47.56,68.61 36.08,68.61 35.07,69.63 ISP1.6
LED_A  (via drill 0.51)
  Top 0.203: v20.54,97.37 19.62,96.45 U1.30 | v30.9,92.49 33.14,92.49 34.87,94.22 R9.2
  Bottom 0.203: v20.54,97.37 20.54,96.15 21.96,94.72 27.04,94.72 27.25,94.93 28.46,94.93 v30.9,92.49
LED_B
  Top 0.203: U1.31 19.12,96.96 19.12,97.16 20.95,98.99 23.08,98.99 27.04,95.03 27.04,93.3 29.99,90.36 33.85,90.36 34.87,89.34 R17.2
LED_C  (via drill 0.51)
  Top 0.203: v18.51,95.33 16.37,97.47 U1.1 | v33.95,82.84 33.95,83.24 34.97,84.26 R18.2
  Bottom 0.203: v18.51,95.33 20.74,95.33 21.76,94.32 27.25,94.32 27.45,94.52 28.26,94.52 30.09,92.69 30.09,86.7 v33.95,82.84
LED_D  (via drill 0.51)
  Top 0.203: v18.1,98.59 16.07,98.59 15.36,97.88 15.36,97.67 15.76,97.27 15.76,96.96 U1.2 | v23.28,95.94 23.28,94.72 24.6,93.4 24.6,89.75 25.82,88.53 25.82,82.94 30.6,78.16 33.85,78.16 34.87,79.18 R19.2
  Bottom 0.203: v18.1,98.59 22.88,98.59 23.28,98.18 v23.28,95.94
MISO  (via drill 0.51)
  Top 0.203: v17.09,86.7 16.37,87.41 U1.16 | v26.64,83.35 v26.64,88.12
  Bottom 0.203: v17.09,86.7 17.09,89.24 17.49,89.64 18.3,89.64 18.71,89.24 19.93,89.24 22.37,91.68 22.37,92.59 22.77,93 23.59,93 26.64,89.95 v26.64,88.12 | v26.64,83.35 26.64,82.13 32.43,76.34 32.43,74.81 ISP1.1
MOSI  (via drill 0.51)
  Top 0.203: 46.45,30.51 52.65,30.51 53.36,31.22 53.36,35.9 52.54,36.71 51.93,36.71 U$3.5 | 46.45,30.51 42.18,30.51 41.06,31.63 41.06,36.1 41.67,36.71 U$4.5 | v18.91,85.38 17.09,85.38 15.36,87.1 15.36,87.31 15.76,87.71 15.76,88.02 U1.15 | v46.45,30.62 46.45,30.51 | v40.76,51.24 40.76,53.07 41.27,53.58 v41.27,64.04
  Bottom 0.203: v18.91,85.38 21.05,85.38 24.4,82.02 24.4,81.31 24.81,80.91 26.43,80.91 29.58,77.76 29.58,73.08 29.99,72.68 31.31,72.68 32.02,73.39 33.85,73.39 34.97,72.27 ISP1.4 34.97,72.17 33.85,71.05 33.85,69.33 35.17,68 39.44,68 41.27,66.18 v41.27,64.04 | v46.45,30.62 46.45,37.63 41.27,42.81 41.27,48.9 40.76,49.41 v40.76,51.24
N$1
  Top 0.203: U1.7 12.92,94.12 11.8,95.23 11.7,95.23 10.89,96.05 10.89,96.45 9.46,97.88 8.55,97.88 C1.1 8.45,97.88 4.59,97.88 3.47,96.76 Q1.2
N$2
  Top 0.203: U1.8 12.31,93.51 10.48,93.51 8.55,91.58 C2.1 8.45,91.47 7.84,91.47 3.47,87.1 Q1.1
N$3
  Top 0.203: T2.B 62.4,38.34 62.09,38.34 56.4,44.03 53.25,44.03 R3.2 53.15,44.13 51.22,46.06 40.55,46.06 39.54,45.04 39.54,44.94 38.73,44.13 R2.1
N$4
  Top 0.203: R2.2 40.45,44.03 39.44,43.01 37.81,43.01 37.61,43.21 37.61,45.55 40.15,48.09 40.15,49.41 44.82,54.08 44.82,59.37 48.17,62.72 51.73,62.72 52.34,63.33 52.34,75.12 53.46,76.23 GATE2.TIP
N$5  (via drill 0.51)
  Top 0.203: v57.32,47.48 61.59,47.48 T3.B | v56.51,25.03 57.73,25.03 58.13,25.43 59.35,25.43 | 59.35,25.43 61.28,25.43 61.38,25.33 63.01,25.33 64.02,26.35 R13.2 | 59.35,25.43 59.35,22.69 52.85,16.19 50.71,16.19 48.38,13.85 R8.1
  Bottom 0.203: v57.32,47.48 54.58,47.48 50.41,51.65 49.6,51.65 49.09,51.14 49.09,41.18 54.17,36.1 54.17,27.36 v56.51,25.03
N$6  (via drill 0.51)
  Top 0.203: v46.45,12.73 49.19,12.73 50.21,13.75 R8.2
  Bottom 0.203: v46.45,12.73 46.45,9.89 44.21,7.65 44.21,6.84 46.35,4.71 47.46,4.71 47.87,4.3 47.87,3.18 47.56,2.88 47.56,2.07 47.97,1.66 48.78,1.66 66.16,19.03 66.16,53.17 63.21,56.12 63.21,56.52 56.1,63.64 53.66,63.64 53.25,64.04 53.25,65.77 53.46,65.97 GATE3.TIP
N$7
  Top 0.203: 48.07,9.89 49.09,10.91 49.29,10.91 51.32,12.94 51.32,13.55 59.76,21.98 61.48,21.98 65.85,26.35 65.85,39.66 62.6,42.91 62.3,42.91 T4.B | 48.07,9.89 44.82,13.14 R16.2 | 48.07,9.89 R15.1
N$8  (via drill 0.51)
  Top 0.203: v60.16,21.17 58.54,19.54 58.54,19.03 49.9,10.4 49.9,9.89 R15.2
  Bottom 0.203: v60.16,21.17 60.16,28.68 65.75,34.27 65.75,50.63 59.96,56.42 59.96,57.34 59.86,57.44 57.22,57.44 56.4,56.62 56.4,55.2 56,54.8 54.68,54.8 53.56,55.91 GATE4.TIP
N$9
  Top 0.203: D1.A 4.08,9.58 22.16,9.58 24.81,6.94 POWER.10 24.91,6.84 24.91,4.4 POWER.9
N$10
  Top 0.203: D2.C 34.87,3.89 26.23,3.89 25.31,2.98 16.07,2.98 14.75,4.3 POWER.1 14.75,4.4 14.75,6.84 POWER.2
N$11  (via drill 0.51)
  Top 0.203: v49.19,25.54 48.68,26.04 46.55,26.04 IC1.8 | v50.41,22.08 50.41,21.57 50.1,21.27 50.1,20.46 50.82,19.74 52.65,19.74 IC1.2
  Bottom 0.203: v49.19,25.54 49.19,23.3 v50.41,22.08
N$12  (via drill 0.51)
  Top 0.203: v11.9,43.72 4.28,51.34 R10.1 | v23.08,13.24 27.35,13.24 34.97,5.62 36.29,5.62 38.52,3.39 38.52,3.08 39.44,2.17 48.07,2.17 v48.38,2.47
  Bottom 0.203: v11.9,43.72 11.9,39.66 17.09,34.48 17.09,24.21 20.84,20.46 20.84,15.48 v23.08,13.24 | v48.38,2.47 57.93,12.02 57.93,24.01 57.73,24.21 57.73,27.67 56.1,29.29 56.1,32.75 MODESW.2
N$13  (via drill 0.51)
  Top 0.203: IC5.9 38.12,24.82 38.12,25.94 IC5.8 38.01,26.04 v38.01,30.62 | v34.05,42.71 34.05,67.09 42.48,75.52 42.48,83.35 39.64,86.19 CV1.TIP
  Bottom 0.203: v38.01,30.62 38.01,38.74 v34.05,42.71
N$14
  Top 0.203: IC1.1 52.65,18.53 51.43,18.53 49.6,20.35 49.6,22.49 51.83,24.72 52.65,24.72 IC1.6
N$15
  Top 0.203: T1.B 4.28,71.86 4.28,75.22 R7.2 4.18,75.32 4.18,77.05 2.35,78.88 2.35,80.09 R6.1
N$18
  Top 0.203: R6.2 4.28,80.09 4.28,77.55 6.11,75.73 6.11,71.15 4.99,70.04 4.99,64.24 2.96,62.21 2.96,53.98 1.34,52.36 1.34,42.2 7.23,36.3 7.23,35.7 14.65,28.28 21.96,28.28 34.87,41.18 34.87,46.87 34.66,47.08 34.66,67.09 53.46,85.89 53.46,86.19 GATE1.TIP
N$19
  Top 0.203: R9.1 33.04,94.32 30.19,94.32 28.36,96.15 28.36,97.98 28.67,98.28 59.25,98.28 62.2,95.33 D3.A
N$20  (via drill 0.51)
  Top 0.203: v41.37,93.81 35.68,88.12 34.26,88.12 33.14,89.24 R17.1
  Bottom 0.203: v41.37,93.81 53.76,93.81 55.19,95.23 D4.A
N$21
  Top 0.203: R18.1 33.14,84.36 42.99,94.22 47.16,94.22 48.17,95.23 D5.A
N$22  (via drill 0.51)
  Top 0.203: v38.01,85.48 33.14,80.6 33.14,79.28 R19.1
  Bottom 0.203: v38.01,85.48 38.01,91.98 41.27,95.23 D6.A
N$25  (via drill 0.51)
  Top 0.203: IC5.6 43.3,24.82 43.3,25.94 IC5.7 43.3,26.04 v46.24,28.99
  Bottom 0.203: v46.24,28.99 46.24,29.19 47.26,30.21 47.26,37.42 41.67,43.01 41.67,49.11 41.47,49.31 41.47,50.73 41.57,50.83 41.57,51.65 39.64,53.58 39.64,55.91 CV4.TIP
N$31  (via drill 0.51)
  Top 0.203: IC5.1 43.3,18.42 43.3,19.64 IC5.2 43.2,19.74 42.08,19.74 v40.86,20.96
  Bottom 0.203: v40.86,20.96 40.86,21.57 40.45,21.98 40.45,43.72 38.12,46.06 38.12,64.65 39.54,66.07 CV3.TIP
N$36  (via drill 0.51)
  Top 0.203: IC5.14 38.12,18.42 38.12,19.64 IC5.13 38.01,19.74 37.3,19.74 33.44,23.61 33.44,39.15 35.27,40.98 35.27,47.08 35.07,47.28 35.07,63.84 v40.86,69.63
  Bottom 0.203: v40.86,69.63 40.86,75.02 39.64,76.23 CV2.TIP
N$69
  Top 0.203: R60.2 26.94,72.17 25.01,70.24 18.61,70.24 16.68,72.17 15.56,72.17 U4.3
POT_A
  Top 0.203: U4.13 20.54,70.95 20.95,70.95 24.91,74.91 24.91,76.23 POT_A.P$2
POT_D
  Top 0.203: U4.14 20.44,72.27 17.19,72.27 16.68,72.78 14.34,72.78 14.24,72.68 14.24,71.76 14.44,71.56 16.68,71.56 19.12,69.12 19.12,66.68 19.32,66.48 22.57,66.48 24.81,64.24 24.81,56.42 24.91,56.32 POT_D.P$2
POT_R  (via drill 0.51)
  Top 0.203: v22.27,69.43 22.06,69.63 20.54,69.63 U4.12 | v18.61,65.77 18.61,57.84 16.58,55.81 16.58,44.74 v21.25,40.06
  Bottom 0.203: v18.61,65.77 v22.27,69.43 | v21.25,40.06 21.25,25.23 22.47,24.01 22.47,18.02 21.25,16.8 21.25,15.68 21.96,14.97 23.69,14.97 24.91,16.19 POT_R.P$2
POT_S  (via drill 0.51)
  Top 0.203: v17.39,74.2 18.41,74.2 19.12,73.49 20.44,73.49 U4.15 | v26.64,60.59 26.64,58.96 29.07,56.52 29.07,45.55 27.55,44.03 27.55,38.03 28.77,36.81 28.77,35.7 28.06,34.98 26.23,34.98 25.01,36.2 POT_S.P$2
  Bottom 0.203: v17.39,74.2 17.39,64.45 18.71,63.13 18.71,62.52 20.64,60.59 v26.64,60.59
POT_SA
  Top 0.203: U4.1 15.46,74.81 12.51,74.81 11.09,76.23 POT_SA.P$2
POT_SD
  Top 0.203: U4.5 15.46,69.63 15.05,69.63 11.19,65.77 11.19,56.42 11.09,56.32 POT_SD.P$2
POT_SR
  Top 0.203: U4.4 15.56,70.85 16.07,70.85 17.8,69.12 17.8,57.64 15.56,55.41 15.56,46.06 11.09,41.59 11.09,36.3 POT_SR.P$2
POT_ST
  Top 0.203: U4.2 15.56,73.39 18.61,73.39 19.22,72.78 21.55,72.78 21.86,73.08 21.86,75.12 16.27,80.7 5.6,80.7 4.99,81.31 1.64,81.31 0.42,80.09 0.42,39.05 2.56,36.92 2.66,36.92 10.99,28.58 10.99,16.29 POT_ST.P$2
RST  (via drill 0.51)
  Top 0.203: v31.21,78.98 31.21,84.77 26.64,89.34 26.64,93.81 23.69,96.76 21.35,96.76 20.44,95.84 20.23,95.84 U1.29 | v33.65,76.54 33.65,70.85 32.53,69.73 ISP1.5
  Bottom 0.203: v33.65,76.54 v31.21,78.98
S0  (via drill 0.51)
  Top 0.203: v23.38,89.44 21.96,90.86 U1.23 | v25.01,88.12 25.01,83.14 26.03,82.13 v26.03,80.09 | v26.13,70.14 25.52,70.14 25.11,69.73 23.79,69.73 22.47,68.41 20.54,68.41 U4.11
  Bottom 0.203: v23.38,89.44 23.69,89.44 v25.01,88.12 | v26.03,80.09 23.18,80.09 19.22,76.13 19.22,75.32 24.4,70.14 v26.13,70.14
S1  (via drill 0.51)
  Top 0.203: v23.18,92.19 22.47,91.47 U1.24 | v30.39,73.49 30.39,68.21 v29.18,66.99 | v22.27,67.29 20.64,67.29 20.54,67.19 U4.10
  Bottom 0.203: v23.18,92.19 23.18,90.46 20.84,88.12 20.84,86.9 25.21,82.53 25.62,82.53 30.39,77.76 v30.39,73.49 | v29.18,66.99 24.91,66.99 22.67,64.75 21.86,64.75 21.45,65.16 21.45,66.48 v22.27,67.29
S2  (via drill 0.51)
  Top 0.203: v20.84,91.98 22.37,93.51 U1.25 | v15.97,89.85 v15.97,91.98 | v22.27,65.57 20.74,65.57 20.54,65.77 U4.9
  Bottom 0.203: v15.97,91.98 v20.84,91.98 | v15.97,89.85 15.97,85.28 17.39,83.85 17.39,75.52 23.08,69.83 23.08,66.38 v22.27,65.57
SCK  (via drill 0.51)
  Top 0.203: v48.48,36.2 48.38,36.1 45.43,36.1 44.82,35.49 42.99,35.49 U$4.4 | v49.09,34.58 50.41,34.58 51.22,35.39 51.83,35.39 U$3.4 | v19.52,86.5 19.42,86.5 18.51,87.41 U1.17 | v25.21,81.72 25.21,79.69 26.13,78.77 27.75,78.77 31.31,75.22 31.31,73.39 32.43,72.27 ISP1.3 32.43,72.17 31.31,71.05 31.31,68.51 30.39,67.6 v30.39,66.99 | v35.88,61.5 v38.93,58.45
  Bottom 0.203: v49.09,34.58 48.48,35.19 v48.48,36.2 48.48,36.81 46.85,38.44 46.85,52.66 44.92,54.59 42.79,54.59 v38.93,58.45 | v19.52,86.5 20.54,86.5 25.21,81.82 v25.21,81.72 | v30.39,66.99 v35.88,61.5
T1  (via drill 0.51)
  Top 0.203: v10.68,88.63 12.92,90.86 U1.10 | v9.16,78.77 7.13,76.74 7.13,70.24 R11.2 7.23,70.24 7.74,69.73 v8.55,69.73 | v43.91,50.53 v49.9,50.53 | v35.88,53.98 v40.45,53.98 | v20.13,56.52 v23.38,59.77
  Bottom 0.203: v10.68,88.63 10.68,80.3 v9.16,78.77 | v49.9,50.53 58.13,42.3 58.13,39.56 MODESW.3 | v40.45,53.98 v43.91,50.53 | v35.88,53.98 32.83,53.98 27.04,59.77 v23.38,59.77 | v20.13,56.52 19.52,56.52 17.59,54.59 8.35,54.59 7.23,55.71 7.23,61.3 8.55,62.62 v8.55,69.73
T2  (via drill 0.51)
  Top 0.203: v12.51,89.24 13.53,90.25 U1.11 | v3.98,60.18 3.98,59.88 4.99,58.86 R12.2 | v47.16,27.16 50.61,27.16 53.46,30.01 58.13,30.01 MODESW.1 | v40.76,7.86 39.95,7.86 21.76,26.04 15.05,26.04 v2.86,38.24
  Bottom 0.203: v12.51,89.24 11.29,89.24 11.09,89.44 8.14,89.44 1.23,82.53 1.23,72.47 3.98,69.73 v3.98,60.18 2.86,59.06 v2.86,38.24 | v47.16,27.16 47.16,18.22 40.76,11.82 v40.76,7.86
TRIG  (via drill 0.51)
  Top 0.203: v26.43,98.59 25.62,99.4 20.64,99.4 18.81,97.57 18.51,97.57 U1.32 | v50.92,20.86 52.54,20.86 52.65,20.96 IC1.3
  Bottom 0.203: v26.43,98.59 26.64,98.59 36.8,88.43 36.8,81.31 50.71,67.39 51.53,67.39 52.34,66.58 52.34,65.77 49.29,62.72 49.29,51.95 47.36,50.02 47.36,38.54 49.9,36 49.9,30.41 49.39,29.9 49.39,26.55 51.22,24.72 51.22,21.17 v50.92,20.86
TRIG1  (via drill 0.51)
  Top 0.203: v17.59,90.97 21.25,94.62 U1.27 | v2.05,70.44 2.56,70.44 3.27,69.73 T1.C 3.27,69.63 1.95,68.31 1.95,64.35 R5.1 | v47.56,17.41 47.87,17.71 47.87,22.79 47.16,23.5 46.55,23.5 IC1.10 | v32.33,18.63 29.58,21.37 27.75,21.37 21.45,27.67 14.65,27.67 v1.23,41.08
  Bottom 0.203: v17.59,90.97 8.04,90.97 0.83,83.75 0.83,71.66 v2.05,70.44 1.95,70.44 1.23,69.73 v1.23,41.08 | v47.56,17.41 47.56,16.8 43.6,12.84 43.6,2.78 42.99,2.17 42.18,2.17 32.33,12.02 v32.33,18.63
TRIG2  (via drill 0.51)
  Top 0.203: v22.06,95.84 21.55,95.84 21.05,95.33 20.74,95.33 U1.28 | v35.98,85.99 37.3,85.99 38.83,87.51 45.13,87.51 47.56,85.07 51.53,85.07 52.34,85.89 52.34,86.8 53.05,87.51 53.97,87.51 55.19,86.29 55.19,57.23 | 55.19,57.23 55.19,56.42 54.78,56.02 54.78,48.8 61.43,42.15 | 61.43,42.15 63.01,40.57 63.31,40.57 T2.C | v44.92,45.25 46.04,44.13 46.24,44.13 R1.1 | v46.04,52.26 49.9,56.12 49.9,56.52 50.61,57.23 55.19,57.23 | v54.98,28.58 53.36,28.58 51.32,26.55 51.32,24.93 50.82,24.42 50,24.42 49.7,24.72 46.55,24.72 IC1.9 | 61.43,42.15 v60.47,41.18
  Bottom 0.203: v22.06,95.84 22.77,95.13 26.84,95.13 27.04,95.33 29.28,95.33 35.98,88.63 v35.98,85.99 | v44.92,45.25 44.92,51.14 v46.04,52.26 | v54.98,28.58 54.98,35.09 57.42,37.52 59.05,37.52 60.47,38.95 v60.47,41.18
TRIG3  (via drill 0.51)
  Top 0.203: 56.56,23.55 56.2,23.91 53.05,23.91 52.75,23.61 IC1.5 | 56.56,23.55 56.61,23.5 56.61,20.56 52.65,16.6 44.31,16.6 40.76,13.04 38.62,13.04 37.51,14.16 R4.1 | v19.12,90.05 19.12,89.34 19.52,88.93 19.52,88.63 U1.19 | v56.71,65.97 56.71,55.41 62.04,50.07 | 62.04,50.07 62.5,49.61 T3.C | v58.54,24.62 57.52,23.61 56.61,23.61 56.56,23.55 | 62.04,50.07 v61.38,49.41
  Bottom 0.203: v19.12,90.05 20.13,90.05 21.66,91.58 21.66,92.39 19.52,94.52 16.68,94.52 15.87,95.33 15.87,97.57 17.69,99.4 26.84,99.4 37.2,89.04 37.2,85.07 44.21,78.06 46.14,78.06 46.85,77.35 46.85,75.83 v56.71,65.97 | v58.54,24.62 58.54,27.67 65.34,34.48 65.34,45.45 v61.38,49.41
TRIG4  (via drill 0.51)
  Top 0.203: v17.9,88.83 17.9,90.05 19.02,91.17 20.13,91.17 20.95,90.36 21.25,90.36 U1.22 | v37.3,64.85 42.79,64.85 44.11,63.53 v51.32,63.53 | v55.59,55.61 55.59,53.98 61.18,48.4 62.3,48.4 62.7,47.99 62.7,45.75 62.75,45.7 | 62.75,45.7 63.21,45.25 T4.C | v60.37,31.83 60.98,31.22 61.69,31.22 R14.1 | 62.75,45.7 v61.99,44.94 | v55.79,23.1 54.98,22.28 52.75,22.28 IC1.4
  Bottom 0.203: v17.9,88.83 17.9,76.03 26.23,67.7 28.67,67.7 28.77,67.8 34.36,67.8 v37.3,64.85 | v51.32,63.53 51.32,59.88 v55.59,55.61 | 62.14,33.61 64.94,36.41 64.94,42 v61.99,44.94 | 62.14,33.61 v60.37,31.83 | v55.79,23.1 57.32,24.62 57.32,27.47 55.69,29.09 55.69,35.19 57.32,36.81 58.94,36.81 62.14,33.61
VOUTA  (via drill 0.51)
  Top 0.203: v40.86,19.74 40.05,20.56 40.05,22.08 38.73,23.4 38.12,23.4 IC5.10 | v44.82,31.33 45.94,31.33 46.24,31.63 46.65,31.63 U$3.14
  Bottom 0.203: v40.86,19.74 41.67,20.56 41.67,26.45 41.47,26.65 41.47,27.97 v44.82,31.33
VOUTB
  Top 0.203: IC5.12 38.01,20.96 36.69,20.96 35.07,22.59 35.07,39.05 37.2,41.18 39.13,41.18 41.67,38.64 44.11,38.64 45.94,36.81 46.65,36.81 U$3.10
VOUTC
  Top 0.203: IC5.3 43.2,20.96 42.69,20.96 39.54,24.11 39.54,30.31 38.22,31.63 U$4.14
VOUTD  (via drill 0.51)
  Top 0.203: v42.28,27.06 41.88,26.65 41.88,24.32 42.69,23.5 43.2,23.5 IC5.5 | v38.83,17.31 v40.86,17.31 | v35.88,35.7 36.08,35.7 37.1,36.71 37.61,36.71 U$4.10
  Bottom 0.203: v42.28,27.06 42.28,18.73 v40.86,17.31 | v38.83,17.31 38.83,28.58 36.69,30.72 36.69,34.88 v35.88,35.7

### Text on the board
tPlace: T1 | Pure QUAD ADSR V1.0 | POWER
bPlace: copyright GMSN Ltd / Andy C 2018 | Attack Shape | ATTACK | Decay Shape | DECAY | Sustain Time | SUSTAIN | RELEASE Shape | RELEASE | Pure Quad ADSR / PCB1